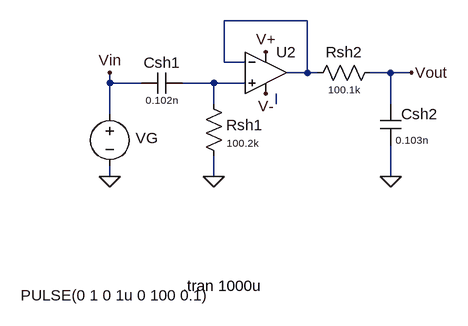
[diagram p0: schematic shaper_sim.asc]
shaper_sim.asc, the LTspice schematic file:
Version 4
SHEET 1 880 680
WIRE -640 -176 -768 -176
WIRE -768 -112 -768 -176
WIRE -736 -112 -768 -112
WIRE -640 -96 -640 -176
WIRE -640 -96 -672 -96
WIRE -624 -96 -640 -96
WIRE -512 -96 -544 -96
WIRE -480 -96 -512 -96
WIRE -944 -80 -944 -96
WIRE -896 -80 -944 -80
WIRE -784 -80 -832 -80
WIRE -736 -80 -784 -80
WIRE -784 -48 -784 -80
WIRE -688 -48 -688 -64
WIRE -512 -48 -512 -96
WIRE -944 -32 -944 -80
WIRE -944 64 -944 48
WIRE -784 64 -784 32
WIRE -512 64 -512 16
FLAG -480 -96 Vout
FLAG -944 -96 Vin
FLAG -704 -64 V-
FLAG -704 -128 V+
FLAG -944 64 0
FLAG -784 64 0
FLAG -512 64 0
SYMBOL Opamps/UniversalOpamp2 -704 -96 R0
SYMATTR InstName U2
SYMBOL voltage -944 -48 R0
WINDOW 3 -137 295 Left 2
WINDOW 39 0 0 Left 0
WINDOW 0 40 53 Left 2
SYMATTR Value PULSE(0 1 0 1u 0 100 0.1)
SYMATTR Value2 AC 1 0
SYMATTR InstName VG
SYMBOL res -800 -64 R0
WINDOW 0 35 49 Left 2
WINDOW 3 36 76 Left 1
SYMATTR InstName Rsh1
SYMATTR Value 100.2k
SYMBOL res -528 -112 R90
WINDOW 0 0 56 VBottom 2
WINDOW 3 32 56 VTop 1
SYMATTR InstName Rsh2
SYMATTR Value 100.1k
SYMBOL cap -528 -48 R0
WINDOW 0 32 16 Left 2
WINDOW 3 24 56 Left 1
SYMATTR InstName Csh2
SYMATTR Value 0.103n
SYMBOL cap -832 -96 R90
WINDOW 0 0 32 VBottom 2
WINDOW 3 32 32 VTop 1
SYMATTR InstName Csh1
SYMATTR Value 0.102n
TEXT -832 232 Left 2 !.tran 1000u

The netlist it stands for:
* shaper_sim.asc
XU2 N002 N001 V+ V- N001 level.2 Avol=1Meg GBW=10Meg Slew=10Meg ilimit=25m rail=0 Vos=0 phimargin=45 en=0 enk=0 in=0 ink=0 Rin=500Meg  ; pins IN+ IN- V+ V- OUT
VG Vin 0 PULSE(0 1 0 1u 0 100 0.1) AC 1 0
Rsh1 N002 0 100.2k
Rsh2 Vout N001 100.1k
Csh2 Vout 0 0.103n
Csh1 N002 Vin 0.102n
.tran 1000u
.lib UniversalOpamps2.sub
.backanno
.end